# EAGLE schematic AVR_GPS_APRS_Tracker (EAGLE 6.2)
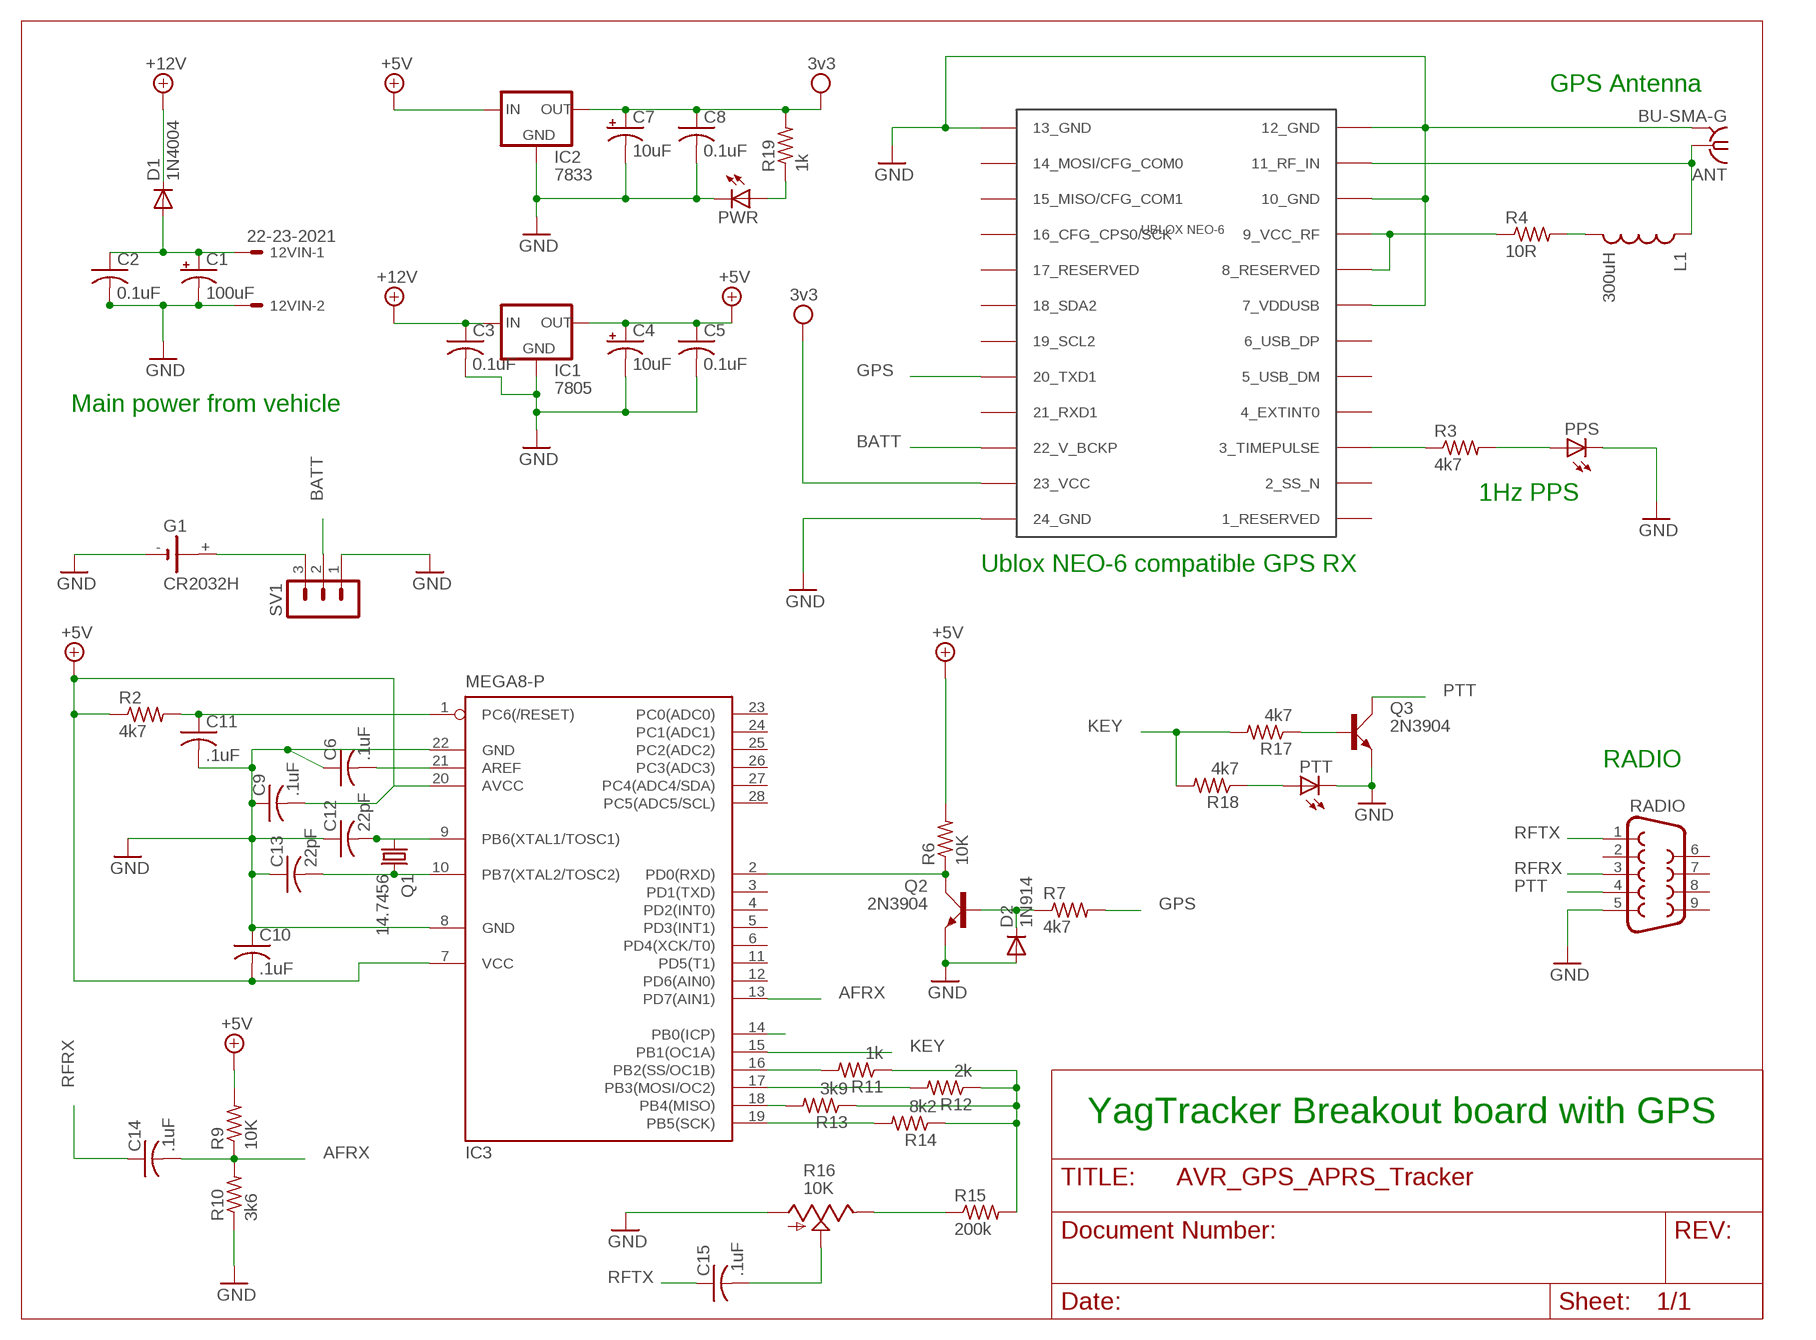
[diagram p0: schematic, sheet 1]

## Parts
12VIN  22-23-2021  [22-23-2021]
ANT  BU-SMA-G  [BU-SMA-G]
C1  100uF  CAP_POLPTH2  [CPOL-RADIAL-10UF-25V]
C2  0.1uF  C-US025-025X050  [C025-025X050]
C3  0.1uF  C-US025-025X050  [C025-025X050]
C4  10uF  CAP_POLPTH2  [CPOL-RADIAL-10UF-25V]
C5  0.1uF  C-US025-025X050  [C025-025X050]
C6  .1uF  C-US025-025X050  [C025-025X050]
C7  10uF  CAP_POLPTH2  [CPOL-RADIAL-10UF-25V]
C8  0.1uF  C-US025-025X050  [C025-025X050]
C9  .1uF  C-US025-025X050  [C025-025X050]
C10  .1uF  C-US025-025X050  [C025-025X050]
C11  .1uF  C-US025-025X050  [C025-025X050]
C12  22pF  C-US025-025X050  [C025-025X050]
C13  22pF  C-US025-025X050  [C025-025X050]
C14  .1uF  C-US025-025X050  [C025-025X050]
C15  .1uF  C-US025-025X050  [C025-025X050]
D1  1N4004  [DO41-10]
D2  1N914  DIODE-D-2.5  [D-2.5]
G1  CR2032H  [CR2032H]
IC1  7805  V_REG_78XX-TO-220  [TO-220-ALT]
IC2  7833  V_REG_78XX-TO-220  [TO-220-ALT]
IC3  MEGA8-P  [DIL28-3]
L1  300uH  INDUCTOR0805  [0805]
PPS  LED0603  [LED-0603]
PTT  LED3MM  [LED3MM]
PWR  LED3MM  [LED3MM]
Q1  14.7456  CRYSTALHC49S  [HC49/S]
Q2  2N3904  [TO92D]
Q3  2N3904  [TO92D]
R2  4k7  R-US_0207/2V  [0207/2V]
R3  4k7  R-US_M0805  [M0805]
R4  10R  R-US_M0805  [M0805]
R6  10K  R-US_0207/2V  [0207/2V]
R7  4k7  R-US_0207/2V  [0207/2V]
R9  10K  R-US_0207/2V  [0207/2V]
R10  3k6  R-US_0207/2V  [0207/2V]
R11  1k  R-US_0207/2V  [0207/2V]
R12  2k  R-US_0207/2V  [0207/2V]
R13  3k9  R-US_0207/2V  [0207/2V]
R14  8k2  R-US_0207/2V  [0207/2V]
R15  200k  R-US_0207/2V  [0207/2V]
R16  10K  TRIM_US-CA6V  [CA6V]
R17  4k7  R-US_0207/2V  [0207/2V]
R18  4k7  R-US_0207/2V  [0207/2V]
R19  1k  R-US_0207/2V  [0207/2V]
RADIO  F09HP  [F09HP]
SV1  MA03-1  [MA03-1]
U$1  UBLOX_NEO-6  [UBLOX_NEO-6P]

## Nets
+5V: C4.1(+) C5.1 C9.2 C10.2 IC1.OUT IC2.IN IC3.7(VCC) IC3.20(AVCC) R2.1 R6.2 R9.2
+12V: C3.1 D1.C IC1.IN
AFRX: C14.2 IC3.13(PD7(AIN1)) R9.1 R10.2
BATT: SV1.2 U$1.22_V_BCKP
GND: 12VIN.2 ANT.2(GND) C1.2(-) C2.2 C3.2 C4.2(-) C5.2 C6.1 C7.2(-) C8.2 C9.1 C10.1 C11.2 C12.1 C13.1 D2.A G1.- IC1.GND IC2.GND IC3.8(GND) IC3.22(GND) PPS.C PTT.K(C) PWR.K(C) Q2.E Q3.E R10.1 R16.A RADIO.5 SV1.1 U$1.7_VDDUSB U$1.10_GND U$1.12_GND U$1.13_GND U$1.24_GND
GPS: R7.2 U$1.20_TXD1
KEY: IC3.15(PB1(OC1A)) R17.2 R18.2
N$1: R3.1 U$1.3_TIMEPULSE
N$2: ANT.1 L1.1 U$1.11_RF_IN
N$3: L1.2 R4.2
N$4: R4.1 U$1.8_RESERVED U$1.9_VCC_RF
N$5: PPS.A R3.2
N$6: PWR.A R19.1
N$7: G1.+ SV1.3
N$8: C13.2 IC3.10(PB7(XTAL2/TOSC2)) Q1.2
N$9: C12.2 IC3.9(PB6(XTAL1/TOSC1)) Q1.1
N$10: C6.2 IC3.21(AREF)
N$11: IC3.16(PB2(SS/OC1B)) R11.2
N$12: IC3.2(PD0(RXD)) Q2.C R6.1
N$14: 12VIN.1 C1.1(+) C2.1 D1.A
N$15: D2.C Q2.B R7.1
N$16: C11.1 IC3.1(PC6(/RESET)) R2.2
N$17: IC3.14(PB0(ICP))
N$19: IC3.17(PB3(MOSI/OC2)) R12.2
N$20: IC3.18(PB4(MISO)) R13.2
N$21: IC3.19(PB5(SCK)) R14.2
N$22: R11.1 R12.1 R13.1 R14.1 R15.2
N$23: R15.1 R16.E
N$24: C15.2 R16.S
N$25: Q3.B R17.1
N$27: PTT.A R18.1
PTT: Q3.C RADIO.4
RFRX: C14.1 RADIO.3
RFTX: C15.1 RADIO.1
VDD: C7.1(+) C8.1 IC2.OUT R19.2 U$1.23_VCC ; supply symbol labelled 3v3
Unconnected: G1.+@1(+) IC3.3(PD1(TXD)) IC3.4(PD2(INT0)) IC3.5(PD3(INT1)) IC3.6(PD4(XCK/T0)) IC3.11(PD5(T1)) IC3.12(PD6(AIN0)) IC3.23(PC0(ADC0)) IC3.24(PC1(ADC1)) IC3.25(PC2(ADC2)) IC3.26(PC3(ADC3)) IC3.27(PC4(ADC4/SDA)) IC3.28(PC5(ADC5/SCL)) RADIO.2 RADIO.6 RADIO.7 RADIO.8 RADIO.9 U$1.1_RESERVED U$1.2_SS_N U$1.4_EXTINT0 U$1.5_USB_DM U$1.6_USB_DP U$1.14_MOSI/CFG_COM0 U$1.15_MISO/CFG_COM1 U$1.16_CFG_CPS0/SCK U$1.17_RESERVED U$1.18_SDA2 U$1.19_SCL2 U$1.21_RXD1

## Notes on the sheet
- GPS Antenna
- Main power from vehicle
- 1Hz PPS
- Ublox NEO-6 compatible GPS RX
- RADIO
- YagTracker Breakout board with GPS

## Power pins joined to a net without a drawn wire
GND: ANT.3(GND) ANT.4(GND) ANT.5(GND)

## Library data of the parts
12VIN = con-molex:22-23-2021: .100" (2.54mm) Center Header - 2 Pin; MF: MOLEX; MPN: 22-23-2021; OC_FARNELL: 1462926; OC_NEWARK: 25C3832
ANT = con-coax:BU-SMA-G: FEMALE SMA CONNECTOR Radiall distributor RS 193-9117; OC_FARNELL: unknown; OC_NEWARK: unknown
C1 C4 C7 = SparkFun :CAP_POL: Capacitor Polarized These are standard SMD and PTH capacitors. Normally 10uF, 47uF, and 100uF in electrolytic and tantalum varieties. Always verify the external diameter of the through hole cap, it varies with capacity, voltage, and manufacturer. The EIA devices should be standard.
C2 C3 C5 C6 C8-C15 = rcl:C-US: CAPACITOR, American symbol
D1 = diode:1N4004: DIODE general purpose rectifier, 1 A
D2 = diode:DIODE-: DIODE
G1 = battery:CR2032H: LI BATTERY Varta
IC1 IC2 = SparkFun :V_REG_78XX: Voltage Regulator Standard 7805 5V regulator. IGO (Input Ground Output). Spark Fun Electronics SKU : COM-00107
IC3 = atmel:MEGA8-P: MICROCONTROLLER 8 Kbytes FLASH, 1 kbytes SRAM, 512 bytes EEPROM, USART, 4-channel 10 bit ADC, 2-channel 8 bit ADC Pin compatible with Atmega48, ATMega88, ATMega168 Source: avr.lbr; OC_FARNELL: unknown; OC_NEWARK: unknown
L1 = SparkFun :INDUCTOR: Inductors Basic Inductor/Choke - 0603 and 1206. Footprints are not proven and vary greatly between part numbers.
PPS PTT PWR = SparkFun :LED: LEDs Standard schematic elements and footprints for 5mm, 3mm, 1206, and 0603 sized LEDs. 5mm - Spark Fun Electronics SKU : COM-00529 (and others)
Q1 = crystal:CRYSTAL: CRYSTAL; OC_FARNELL: 1667008; OC_NEWARK: unknown
Q2 Q3 = transistor-small-signal:2N3904: NPN TRANSISTOR
R2-R4 R6 R7 R9-R15 R17-R19 = resistor:R-US_: RESISTOR, American symbol
R16 = pot:TRIM_US-: POTENTIOMETER
RADIO = con-subd:F09: SUB-D; OC_FARNELL: unknown; OC_NEWARK: unknown
SV1 = con-lstb:MA03-1: PIN HEADER; OC_FARNELL: unknown; OC_NEWARK: unknown
U$1 = Ava:UBLOX_NEO-6: UBLOX NEO-6 GPS MODULE Author Anthony Stirk / http://ava.upuaut.net http://www.u-blox.com/images/downloads/Product_Docs/LEA-6_NEO-6_MAX-6_HardwareIntegrationManual_%28GPS.G6-HW-09007%29.pdf http://www.u-blox.com/images/downloads/Product_Docs/NEO-6_DataSheet_%28GPS.G6-HW-09005%29.pdf